# Altium schematic sheet Copy of 5V Buck.SchDoc
size A; SheetNumber: 1; SheetTotal: 7
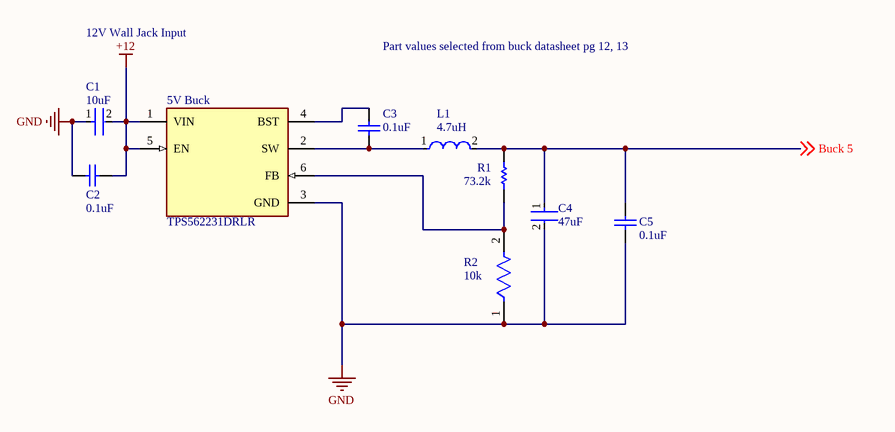
[diagram p0: Copy of 5V Buck.SchDoc]

## Parts
5V_Buck  TPS562231DRLR  [FP-DRL0006A-MFG]
C1  10uF  [FP-CL21-IPC_B]
C2  0.1uF  [CAPC2013X94X50LL20T25]
C3  0.1uF  [CAPC2013X94X50LL20T25]
C4  47uF  [FP-C3216-160-0_2-MFG]
C5  0.1uF  [CAPC2013X94X50LL20T25]
L1  4.7uH  [FP-NR8040-H_4_2-MFG]
R1  73.2k  [RESC1609X50X30NL10T20]
R2  10k  [FP-RK73H1J-IPC_B]

## Nets
+12: 5V_Buck.1(VIN) 5V_Buck.5(EN) C1.2 C2.2
GND: 5V_Buck.3(GND) C1.1 C2.1 C4.2 C5.1 R2.1
Buck 5: C4.1 C5.2 L1.2 R1.2 ; off-sheet Buck 5
Net5V_Buck_2: 5V_Buck.2(SW) C3.1 L1.1
Net5V_Buck_4: 5V_Buck.4(BST) C3.2
Net5V_Buck_6: 5V_Buck.6(FB) R1.1 R2.2

## Notes on the sheet
- 12V Wall Jack Input
- Part values selected from buck datasheet pg 12, 13

## Library data of the parts
5V_Buck = CMP-04918-000372-1: POWER MANAGEMENT
C1 = CMP-13271-004605-1: CL21 Series 0805 10uF 25V ±10% Tolerance X5R Multilayer Ceramic Chip Capacitor; Capacitance: 10uF; Dielectric: X5R; RoHS Compliant: Yes; Voltage Rating (DC): 25V; Case/Package: 0805; Tolerance: 10%
C2 C3 C5 = CMP-2007-04368-1: Part Number: 08055C104JAT4A; Manufacturer: AVX Interconnect / Elco
C4 = CMP-2000-05397-3: Multilayer Ceramic Capacitors 47uF ±20% 25V X5R SMD 1206; Weight: 0.000571oz; Dielectric: X5R; Length: 0.126inch; Voltage Rating: 25V; Case/Package: 1206; Dielectric Material: Ceramic; Min Operating Temperature: -55°C; Lead Free: Lead Free; Packaging: Tape and Reel; Package Quantity: 1; Mount: Surface Mount; Depth: 1.6mm; REACH SVHC: No SVHC; Termination: SMD/SMT; Case Code (Imperial): 1206; Series: C; Resistor Type: Ceramic; Voltage: 25V; Width: 0.063inch; Height: 1.6mm; Tolerance: 20%; Capacitance: 47uF; Max Operating Temperature: 85°C; Voltage Rating (DC): 25V; RoHS Compliant: Yes; Thickness: 0.071inch; Case Code (Metric): 3216
L1 = CMP-14484-000521-1: Shielded Wirewound Inductor 4.7uH 30% 4.1A 23.4mΩ SMD; Core Material: Ferrite; DC Resistance (DCR): 23.4mR; Test Frequency: 100kHz; Self Resonant Frequency: 30MHz; Max DC Current: 4.7A; Number of Pins: 2; Width: 0.315inch; Shielding: Shielded; Radiation Hardening: No; Min Operating Temperature: -25°C; Packaging: Tape and Reel; Max Operating Temperature: 120°C; Tolerance: 30%; Current Rating: 4.1A; Halogen Free: Halogen Free; Lead Free: Lead Free; Package Quantity: 1000; Mount: Surface Mount; RoHS Compliant: Yes; Case/Package: 3131; Inductance: 4.7uH; Saturation Current: 4.7A; Depth: 8.2mm; Length: 0.315inch; Height: 0.157inch; Termination: SMD/SMT; Series: NR
R1 = CMP-2000-03565-1: Manufacturer: Vishay Dale; Part Number: CRCW060373K2FKEA
R2 = CMP-2000-01751-2: 10kΩ ±1% 0.1W Chip Resistor 0603 Thick Film AEC-Q200 Qualified; Power Rating: 100mW; Temperature Coefficient: 100ppm/°C; Resistance: 10kR; Voltage Rating: 50V; Construction: Rectangular; Max Operating Temperature: 155°C; Resistor Type: Thick Film; Case/Package: 0603; Military Standard: MIL-R-55342F; Depth: 0.8mm; Termination: SMD/SMT; Min Operating Temperature: -55°C; RoHS Compliant: Yes; Width: 0.8mm; Length: 1.6mm; Height: 0.45mm; Case Code (Metric): 1608; Package Quantity: 10000; Lead Free: Lead Free; Series: RK73H; Packaging: Tape and Reel; Case Code (Imperial): 0603; Tolerance: 1%